# Altium schematic sheet 01_Top.SchDoc: OpenCamera Slider - Top level schematic
size A4; SheetNumber: 1; SheetTotal: 4; Distributor: DigiKey
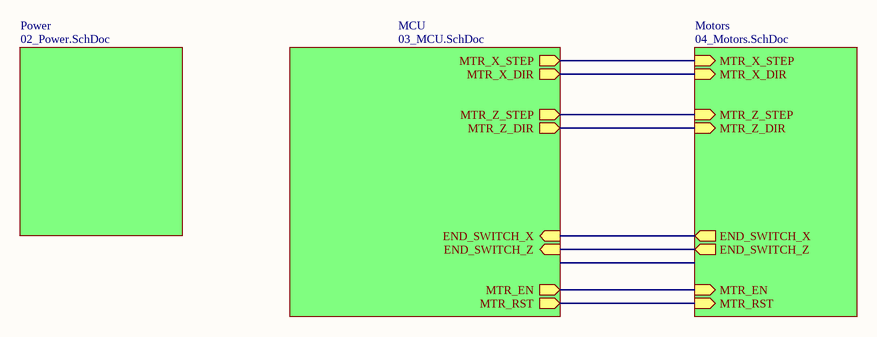
[diagram p0: 01_Top.SchDoc]

## Sub-sheets
MCU = 03_MCU.SchDoc: MTR_X_STEP (out), MTR_X_DIR (out), MTR_Z_STEP (out), MTR_Z_DIR (out), END_SWITCH_X (in), END_SWITCH_Z (in), MTR_EN (out), MTR_RST (out)
Motors = 04_Motors.SchDoc: MTR_X_STEP (in), MTR_Z_STEP (in), MTR_X_DIR (in), MTR_Z_DIR (in), END_SWITCH_Z (out), END_SWITCH_X (out), MTR_RST (in), MTR_EN (in)
Power = 02_Power.SchDoc: no entries

## Nets
(unnamed): sheet MCU/MTR_X_STEP, sheet Motors/MTR_X_STEP
(unnamed): sheet MCU/MTR_X_DIR, sheet Motors/MTR_X_DIR
(unnamed): sheet MCU/MTR_Z_STEP, sheet Motors/MTR_Z_STEP
(unnamed): sheet MCU/MTR_Z_DIR, sheet Motors/MTR_Z_DIR
(unnamed): sheet MCU/END_SWITCH_X, sheet Motors/END_SWITCH_X
(unnamed): sheet MCU/END_SWITCH_Z, sheet Motors/END_SWITCH_Z
(unnamed): sheet MCU/MTR_EN, sheet Motors/MTR_EN
(unnamed): sheet MCU/MTR_RST, sheet Motors/MTR_RST

## Notes on the sheet
- sasakaranovic.com/youtube
- sasakaranovic.com
- sasakaranovic.com/github
- sasakaranovic.com/facebook
- sasakaranovic.com/twitter
- sasakaranovic.com/linkedin